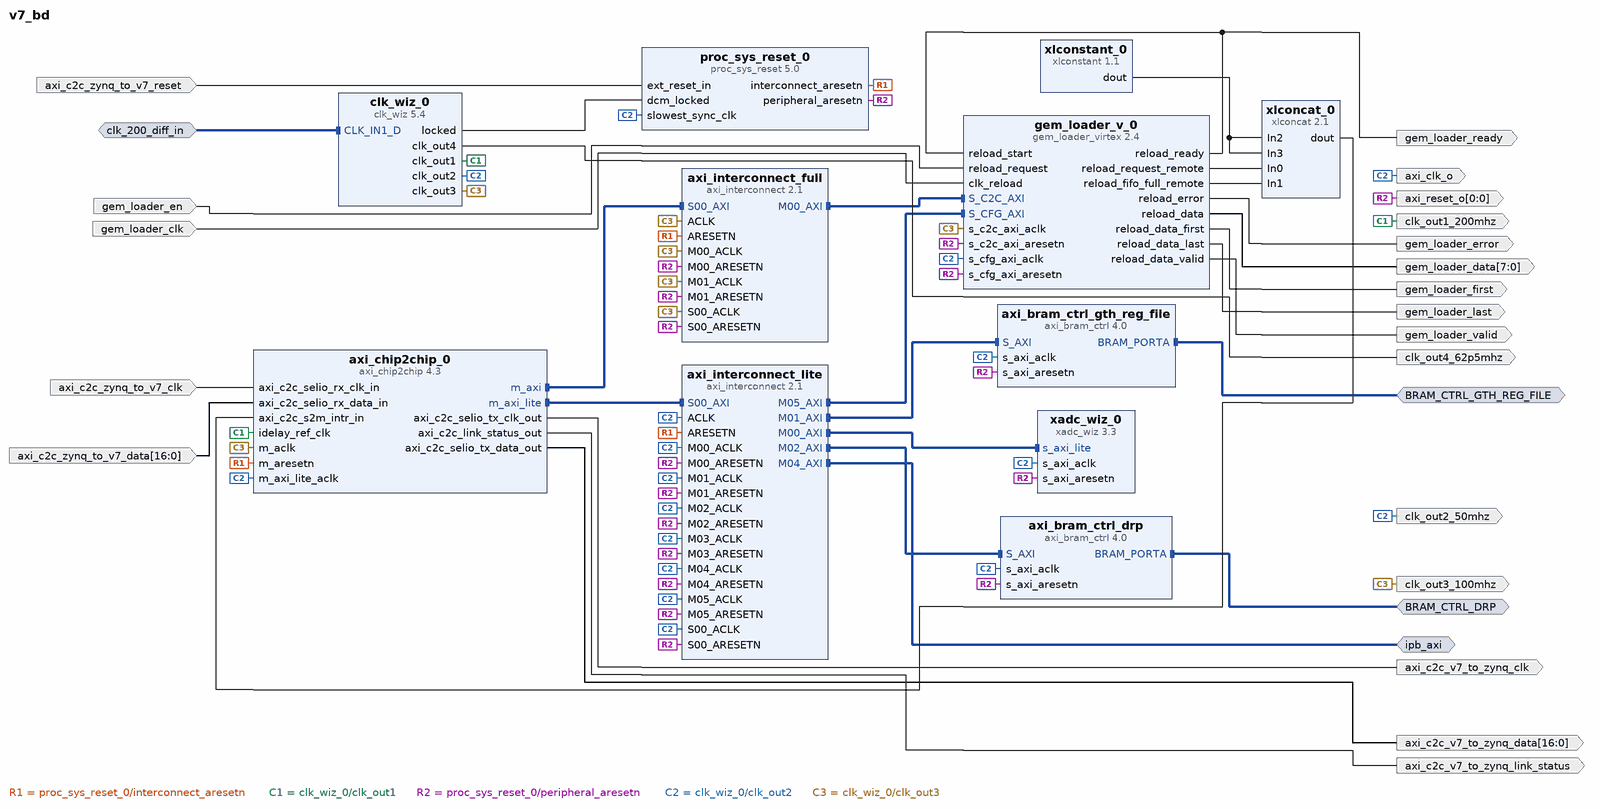
[diagram p0: block diagram of the top level]
# Vivado block design v7_bd, xc7vx690tffg1927-2, Vivado 2017.2
create_bd_design v7_bd

create_bd_intf_port -mode Master -vlnv xilinx.com:interface:bram_rtl:1.0 BRAM_CTRL_DRP
set_property -dict {CONFIG.MASTER_TYPE BRAM_CTRL} [get_bd_intf_ports BRAM_CTRL_DRP]
create_bd_intf_port -mode Master -vlnv xilinx.com:interface:bram_rtl:1.0 BRAM_CTRL_GTH_REG_FILE
set_property -dict {CONFIG.MASTER_TYPE BRAM_CTRL} [get_bd_intf_ports BRAM_CTRL_GTH_REG_FILE]
create_bd_intf_port -mode Slave -vlnv xilinx.com:interface:diff_clock_rtl:1.0 clk_200_diff_in
set_property -dict {CONFIG.FREQ_HZ 200000000} [get_bd_intf_ports clk_200_diff_in]
create_bd_intf_port -mode Master -vlnv xilinx.com:interface:aximm_rtl:1.0 ipb_axi
set_property -dict [list \
  CONFIG.DATA_WIDTH 32 \
  CONFIG.PROTOCOL AXI4LITE \
  CONFIG.ADDR_WIDTH 28 \
  CONFIG.HAS_BURST 0 \
  CONFIG.HAS_LOCK 0 \
  CONFIG.HAS_CACHE 0 \
  CONFIG.HAS_QOS 0 \
  CONFIG.HAS_REGION 0 \
] [get_bd_intf_ports ipb_axi]
create_bd_port -dir I -type clk axi_c2c_zynq_to_v7_clk
set_property -dict {CONFIG.FREQ_HZ 250000000} [get_bd_ports axi_c2c_zynq_to_v7_clk]
create_bd_port -dir I -from 16 -to 0 axi_c2c_zynq_to_v7_data
create_bd_port -dir I -type rst axi_c2c_zynq_to_v7_reset
create_bd_port -dir O axi_c2c_v7_to_zynq_link_status
create_bd_port -dir O -type clk axi_c2c_v7_to_zynq_clk
create_bd_port -dir O -type clk clk_out1_200mhz
create_bd_port -dir O -from 0 -to 0 -type rst axi_reset_o
create_bd_port -dir O -type clk axi_clk_o
set_property -dict {CONFIG.ASSOCIATED_BUSIF ipb_axi CONFIG.ASSOCIATED_RESET axi_reset_o} [get_bd_ports axi_clk_o]
create_bd_port -dir O -type clk clk_out2_50mhz
create_bd_port -dir O -from 16 -to 0 axi_c2c_v7_to_zynq_data
create_bd_port -dir O -type clk clk_out3_100mhz
create_bd_port -dir O gem_loader_ready
create_bd_port -dir O gem_loader_error
create_bd_port -dir O gem_loader_first
create_bd_port -dir O gem_loader_valid
create_bd_port -dir O -from 7 -to 0 -type data gem_loader_data
create_bd_port -dir I gem_loader_en
create_bd_port -dir I -type clk gem_loader_clk
set_property -dict {CONFIG.FREQ_HZ 80000000} [get_bd_ports gem_loader_clk]
create_bd_port -dir O gem_loader_last
create_bd_port -dir O -type clk clk_out4_62p5mhz

create_bd_cell -type ip -vlnv xilinx.com:ip:axi_bram_ctrl:4.0 axi_bram_ctrl_drp
set_property -dict {CONFIG.PROTOCOL AXI4LITE CONFIG.SINGLE_PORT_BRAM 1} [get_bd_cells axi_bram_ctrl_drp]
create_bd_cell -type ip -vlnv xilinx.com:ip:axi_bram_ctrl:4.0 axi_bram_ctrl_gth_reg_file
set_property -dict {CONFIG.PROTOCOL AXI4LITE CONFIG.SINGLE_PORT_BRAM 1} [get_bd_cells axi_bram_ctrl_gth_reg_file]
create_bd_cell -type ip -vlnv xilinx.com:ip:axi_chip2chip:4.3 axi_chip2chip_0
set_property -dict [list \
  CONFIG.C_AXI_WUSER_WIDTH 0 \
  CONFIG.C_M_AXI_WUSER_WIDTH 0 \
  CONFIG.C_AXI_ID_WIDTH 7 \
  CONFIG.C_M_AXI_ID_WIDTH 8 \
  CONFIG.C_INCLUDE_AXILITE 2 \
  CONFIG.C_SELECTIO_PHY_CLK 200 \
  CONFIG.C_INTERFACE_MODE 1 \
  CONFIG.C_COMMON_CLK 0 \
  CONFIG.C_MASTER_FPGA 0 \
  CONFIG.C_AURORA_WIDTH 64 \
] [get_bd_cells axi_chip2chip_0]
create_bd_cell -type ip -vlnv xilinx.com:ip:axi_interconnect:2.1 axi_interconnect_lite
set_property -dict {CONFIG.NUM_SI 1 CONFIG.NUM_MI 6} [get_bd_cells axi_interconnect_lite]
create_bd_cell -type ip -vlnv xilinx.com:ip:axi_interconnect:2.1 axi_interconnect_full
create_bd_cell -type ip -vlnv xilinx.com:ip:clk_wiz:5.4 clk_wiz_0
set_property -dict [list \
  CONFIG.USE_PHASE_ALIGNMENT false \
  CONFIG.USE_DYN_RECONFIG false \
  CONFIG.PRIM_IN_FREQ 200 \
  CONFIG.CLKIN1_JITTER_PS 50.0 \
  CONFIG.CLKOUT2_USED true \
  CONFIG.CLKOUT3_USED true \
  CONFIG.CLKOUT4_USED true \
  CONFIG.NUM_OUT_CLKS 4 \
  CONFIG.CLKOUT1_REQUESTED_OUT_FREQ 200 \
  CONFIG.CLKOUT2_REQUESTED_OUT_FREQ 50 \
  CONFIG.CLKOUT4_REQUESTED_OUT_FREQ 62.5 \
  CONFIG.PRIM_SOURCE Differential_clock_capable_pin \
  CONFIG.CLKOUT1_DRIVES BUFGCE \
  CONFIG.CLKOUT2_DRIVES BUFGCE \
  CONFIG.CLKOUT3_DRIVES BUFGCE \
  CONFIG.CLKOUT4_DRIVES BUFGCE \
  CONFIG.CLKOUT5_DRIVES BUFGCE \
  CONFIG.CLKOUT6_DRIVES BUFGCE \
  CONFIG.CLKOUT7_DRIVES BUFGCE \
  CONFIG.USE_RESET false \
  CONFIG.MMCM_DIVCLK_DIVIDE 1 \
  CONFIG.MMCM_CLKFBOUT_MULT_F 5.000 \
  CONFIG.MMCM_CLKIN1_PERIOD 5.000 \
  CONFIG.MMCM_CLKIN2_PERIOD 10.0 \
  CONFIG.MMCM_CLKOUT0_DIVIDE_F 5.000 \
  CONFIG.MMCM_CLKOUT1_DIVIDE 20 \
  CONFIG.MMCM_CLKOUT2_DIVIDE 10 \
  CONFIG.MMCM_CLKOUT3_DIVIDE 16 \
  CONFIG.USE_SAFE_CLOCK_STARTUP true \
  CONFIG.CLKOUT1_JITTER 98.146 \
  CONFIG.CLKOUT1_PHASE_ERROR 89.971 \
  CONFIG.CLKOUT2_JITTER 129.198 \
  CONFIG.CLKOUT2_PHASE_ERROR 89.971 \
  CONFIG.CLKOUT3_JITTER 112.316 \
  CONFIG.CLKOUT3_PHASE_ERROR 89.971 \
  CONFIG.CLKOUT4_JITTER 123.463 \
  CONFIG.CLKOUT4_PHASE_ERROR 89.971 \
] [get_bd_cells clk_wiz_0]
create_bd_cell -type ip -vlnv xilinx.com:ip:proc_sys_reset:5.0 proc_sys_reset_0
set_property -dict {CONFIG.C_AUX_RESET_HIGH 0} [get_bd_cells proc_sys_reset_0]
create_bd_cell -type ip -vlnv xilinx.com:ip:xadc_wiz:3.3 xadc_wiz_0
set_property -dict [list \
  CONFIG.INTERFACE_SELECTION Enable_AXI \
  CONFIG.DCLK_FREQUENCY 50 \
  CONFIG.ADC_CONVERSION_RATE 962 \
  CONFIG.ENABLE_RESET false \
  CONFIG.OT_ALARM false \
  CONFIG.USER_TEMP_ALARM false \
  CONFIG.VCCINT_ALARM false \
  CONFIG.VCCAUX_ALARM false \
] [get_bd_cells xadc_wiz_0]
create_bd_cell -type ip -vlnv xilinx.com:ip:xlconcat:2.1 xlconcat_0
set_property -dict {CONFIG.NUM_PORTS 4 CONFIG.dout_width 4} [get_bd_cells xlconcat_0]
create_bd_cell -type ip -vlnv xilinx.com:ip:xlconstant:1.1 xlconstant_0
set_property -dict {CONFIG.CONST_VAL 0} [get_bd_cells xlconstant_0]
create_bd_cell -type ip -vlnv wisc.edu:user:gem_loader_virtex:2.4 gem_loader_v_0
set_property -dict {CONFIG.C_FIFO_ENDIAN_CONV_ENABLE true} [get_bd_cells gem_loader_v_0]

# ---- connections ----

connect_bd_intf_net -intf_net axi_interconnect_0_M00_AXI [get_bd_intf_pins axi_interconnect_lite/M00_AXI] [get_bd_intf_pins xadc_wiz_0/s_axi_lite]
connect_bd_intf_net [get_bd_intf_pins gem_loader_v_0/S_C2C_AXI] [get_bd_intf_pins axi_interconnect_full/M00_AXI]
connect_bd_intf_net [get_bd_intf_pins axi_bram_ctrl_gth_reg_file/S_AXI] [get_bd_intf_pins axi_interconnect_lite/M01_AXI]
connect_bd_intf_net [get_bd_intf_pins axi_bram_ctrl_drp/S_AXI] [get_bd_intf_pins axi_interconnect_lite/M02_AXI]
connect_bd_intf_net [get_bd_intf_pins gem_loader_v_0/S_CFG_AXI] [get_bd_intf_pins axi_interconnect_lite/M05_AXI]
connect_bd_intf_net [get_bd_intf_pins axi_chip2chip_0/m_axi_lite] [get_bd_intf_pins axi_interconnect_lite/S00_AXI]
connect_bd_intf_net [get_bd_intf_pins axi_chip2chip_0/m_axi] [get_bd_intf_pins axi_interconnect_full/S00_AXI]
connect_bd_intf_net -intf_net axi_bram_ctrl_1_BRAM_PORTA4 [get_bd_intf_ports BRAM_CTRL_DRP] [get_bd_intf_pins axi_bram_ctrl_drp/BRAM_PORTA]
connect_bd_intf_net -intf_net axi_bram_ctrl_reg_file1_BRAM_PORTA [get_bd_intf_ports BRAM_CTRL_GTH_REG_FILE] [get_bd_intf_pins axi_bram_ctrl_gth_reg_file/BRAM_PORTA]
connect_bd_intf_net [get_bd_intf_ports clk_200_diff_in] [get_bd_intf_pins clk_wiz_0/CLK_IN1_D]
connect_bd_intf_net [get_bd_intf_ports ipb_axi] [get_bd_intf_pins axi_interconnect_lite/M04_AXI]
connect_bd_net -net ARESETN_1 [get_bd_pins proc_sys_reset_0/interconnect_aresetn] \
  [get_bd_pins axi_chip2chip_0/m_aresetn] [get_bd_pins axi_interconnect_lite/ARESETN] \
  [get_bd_pins axi_interconnect_full/ARESETN]
connect_bd_net [get_bd_ports axi_c2c_zynq_to_v7_clk] [get_bd_pins axi_chip2chip_0/axi_c2c_selio_rx_clk_in]
connect_bd_net [get_bd_ports axi_c2c_zynq_to_v7_data] [get_bd_pins axi_chip2chip_0/axi_c2c_selio_rx_data_in]
connect_bd_net [get_bd_ports axi_c2c_zynq_to_v7_reset] [get_bd_pins proc_sys_reset_0/ext_reset_in]
connect_bd_net [get_bd_pins axi_chip2chip_0/axi_c2c_link_status_out] [get_bd_ports axi_c2c_v7_to_zynq_link_status]
connect_bd_net [get_bd_pins axi_chip2chip_0/axi_c2c_selio_tx_clk_out] [get_bd_ports axi_c2c_v7_to_zynq_clk]
connect_bd_net [get_bd_pins clk_wiz_0/clk_out1] [get_bd_ports clk_out1_200mhz] [get_bd_pins axi_chip2chip_0/idelay_ref_clk]
connect_bd_net [get_bd_pins clk_wiz_0/locked] [get_bd_pins proc_sys_reset_0/dcm_locked]
connect_bd_net -net vio_0_probe_out0 [get_bd_pins proc_sys_reset_0/peripheral_aresetn] \
  [get_bd_ports axi_reset_o] [get_bd_pins axi_bram_ctrl_drp/s_axi_aresetn] \
  [get_bd_pins axi_bram_ctrl_gth_reg_file/s_axi_aresetn] [get_bd_pins xadc_wiz_0/s_axi_aresetn] \
  [get_bd_pins gem_loader_v_0/s_c2c_axi_aresetn] [get_bd_pins gem_loader_v_0/s_cfg_axi_aresetn] \
  [get_bd_pins axi_interconnect_lite/S00_ARESETN] [get_bd_pins axi_interconnect_lite/M00_ARESETN] \
  [get_bd_pins axi_interconnect_lite/M01_ARESETN] [get_bd_pins axi_interconnect_lite/M02_ARESETN] \
  [get_bd_pins axi_interconnect_lite/M03_ARESETN] [get_bd_pins axi_interconnect_lite/M04_ARESETN] \
  [get_bd_pins axi_interconnect_lite/M05_ARESETN] [get_bd_pins axi_interconnect_full/S00_ARESETN] \
  [get_bd_pins axi_interconnect_full/M00_ARESETN] [get_bd_pins axi_interconnect_full/M01_ARESETN]
connect_bd_net [get_bd_pins clk_wiz_0/clk_out2] \
  [get_bd_ports clk_out2_50mhz] [get_bd_ports axi_clk_o] [get_bd_pins axi_bram_ctrl_drp/s_axi_aclk] \
  [get_bd_pins axi_bram_ctrl_gth_reg_file/s_axi_aclk] [get_bd_pins axi_chip2chip_0/m_axi_lite_aclk] \
  [get_bd_pins proc_sys_reset_0/slowest_sync_clk] [get_bd_pins xadc_wiz_0/s_axi_aclk] \
  [get_bd_pins gem_loader_v_0/s_cfg_axi_aclk] [get_bd_pins axi_interconnect_lite/ACLK] \
  [get_bd_pins axi_interconnect_lite/S00_ACLK] [get_bd_pins axi_interconnect_lite/M00_ACLK] \
  [get_bd_pins axi_interconnect_lite/M01_ACLK] [get_bd_pins axi_interconnect_lite/M02_ACLK] \
  [get_bd_pins axi_interconnect_lite/M03_ACLK] [get_bd_pins axi_interconnect_lite/M04_ACLK] \
  [get_bd_pins axi_interconnect_lite/M05_ACLK]
connect_bd_net [get_bd_pins axi_chip2chip_0/axi_c2c_selio_tx_data_out] [get_bd_ports axi_c2c_v7_to_zynq_data]
connect_bd_net [get_bd_pins clk_wiz_0/clk_out3] \
  [get_bd_ports clk_out3_100mhz] [get_bd_pins axi_chip2chip_0/m_aclk] [get_bd_pins gem_loader_v_0/s_c2c_axi_aclk] \
  [get_bd_pins axi_interconnect_full/ACLK] [get_bd_pins axi_interconnect_full/S00_ACLK] \
  [get_bd_pins axi_interconnect_full/M00_ACLK] [get_bd_pins axi_interconnect_full/M01_ACLK]
connect_bd_net [get_bd_pins xlconstant_0/dout] [get_bd_pins xlconcat_0/In2] [get_bd_pins xlconcat_0/In3]
connect_bd_net [get_bd_pins xlconcat_0/dout] [get_bd_pins axi_chip2chip_0/axi_c2c_s2m_intr_in]
connect_bd_net [get_bd_pins gem_loader_v_0/reload_request_remote] [get_bd_pins xlconcat_0/In0]
connect_bd_net [get_bd_pins gem_loader_v_0/reload_fifo_full_remote] [get_bd_pins xlconcat_0/In1]
connect_bd_net [get_bd_pins gem_loader_v_0/reload_ready] [get_bd_ports gem_loader_ready] [get_bd_pins gem_loader_v_0/reload_start]
connect_bd_net [get_bd_pins gem_loader_v_0/reload_error] [get_bd_ports gem_loader_error]
connect_bd_net -net gem_loader_v_0_reload_done [get_bd_pins gem_loader_v_0/reload_data_first] [get_bd_ports gem_loader_first]
connect_bd_net [get_bd_pins gem_loader_v_0/reload_data_valid] [get_bd_ports gem_loader_valid]
connect_bd_net [get_bd_pins gem_loader_v_0/reload_data] [get_bd_ports gem_loader_data]
connect_bd_net [get_bd_ports gem_loader_en] [get_bd_pins gem_loader_v_0/reload_request]
connect_bd_net [get_bd_ports gem_loader_clk] [get_bd_pins gem_loader_v_0/clk_reload]
connect_bd_net [get_bd_pins gem_loader_v_0/reload_data_last] [get_bd_ports gem_loader_last]
connect_bd_net [get_bd_pins clk_wiz_0/clk_out4] [get_bd_ports clk_out4_62p5mhz]

# ---- address map ----
assign_bd_address -offset 0x7F000000 -range 64K -target_address_space [get_bd_addr_spaces axi_chip2chip_0/MAXI] [get_bd_addr_segs gem_loader_v_0/S_C2C_AXI/S_C2C_AXI_mem]
assign_bd_address -offset 0x63000000 -range 64K -target_address_space [get_bd_addr_spaces axi_chip2chip_0/MAXI-Lite] [get_bd_addr_segs axi_bram_ctrl_drp/S_AXI/Mem0]
assign_bd_address -offset 0x64000000 -range 64M -target_address_space [get_bd_addr_spaces axi_chip2chip_0/MAXI-Lite] [get_bd_addr_segs ipb_axi/Reg]
assign_bd_address -offset 0x68000000 -range 64K -target_address_space [get_bd_addr_spaces axi_chip2chip_0/MAXI-Lite] [get_bd_addr_segs xadc_wiz_0/s_axi_lite/Reg]
assign_bd_address -offset 0x69000000 -range 128K -target_address_space [get_bd_addr_spaces axi_chip2chip_0/MAXI-Lite] [get_bd_addr_segs axi_bram_ctrl_gth_reg_file/S_AXI/Mem0]
assign_bd_address -offset 0x6A000000 -range 64K -target_address_space [get_bd_addr_spaces axi_chip2chip_0/MAXI-Lite] [get_bd_addr_segs gem_loader_v_0/S_CFG_AXI/S_CFG_AXI_reg]

validate_bd_design
save_bd_design
